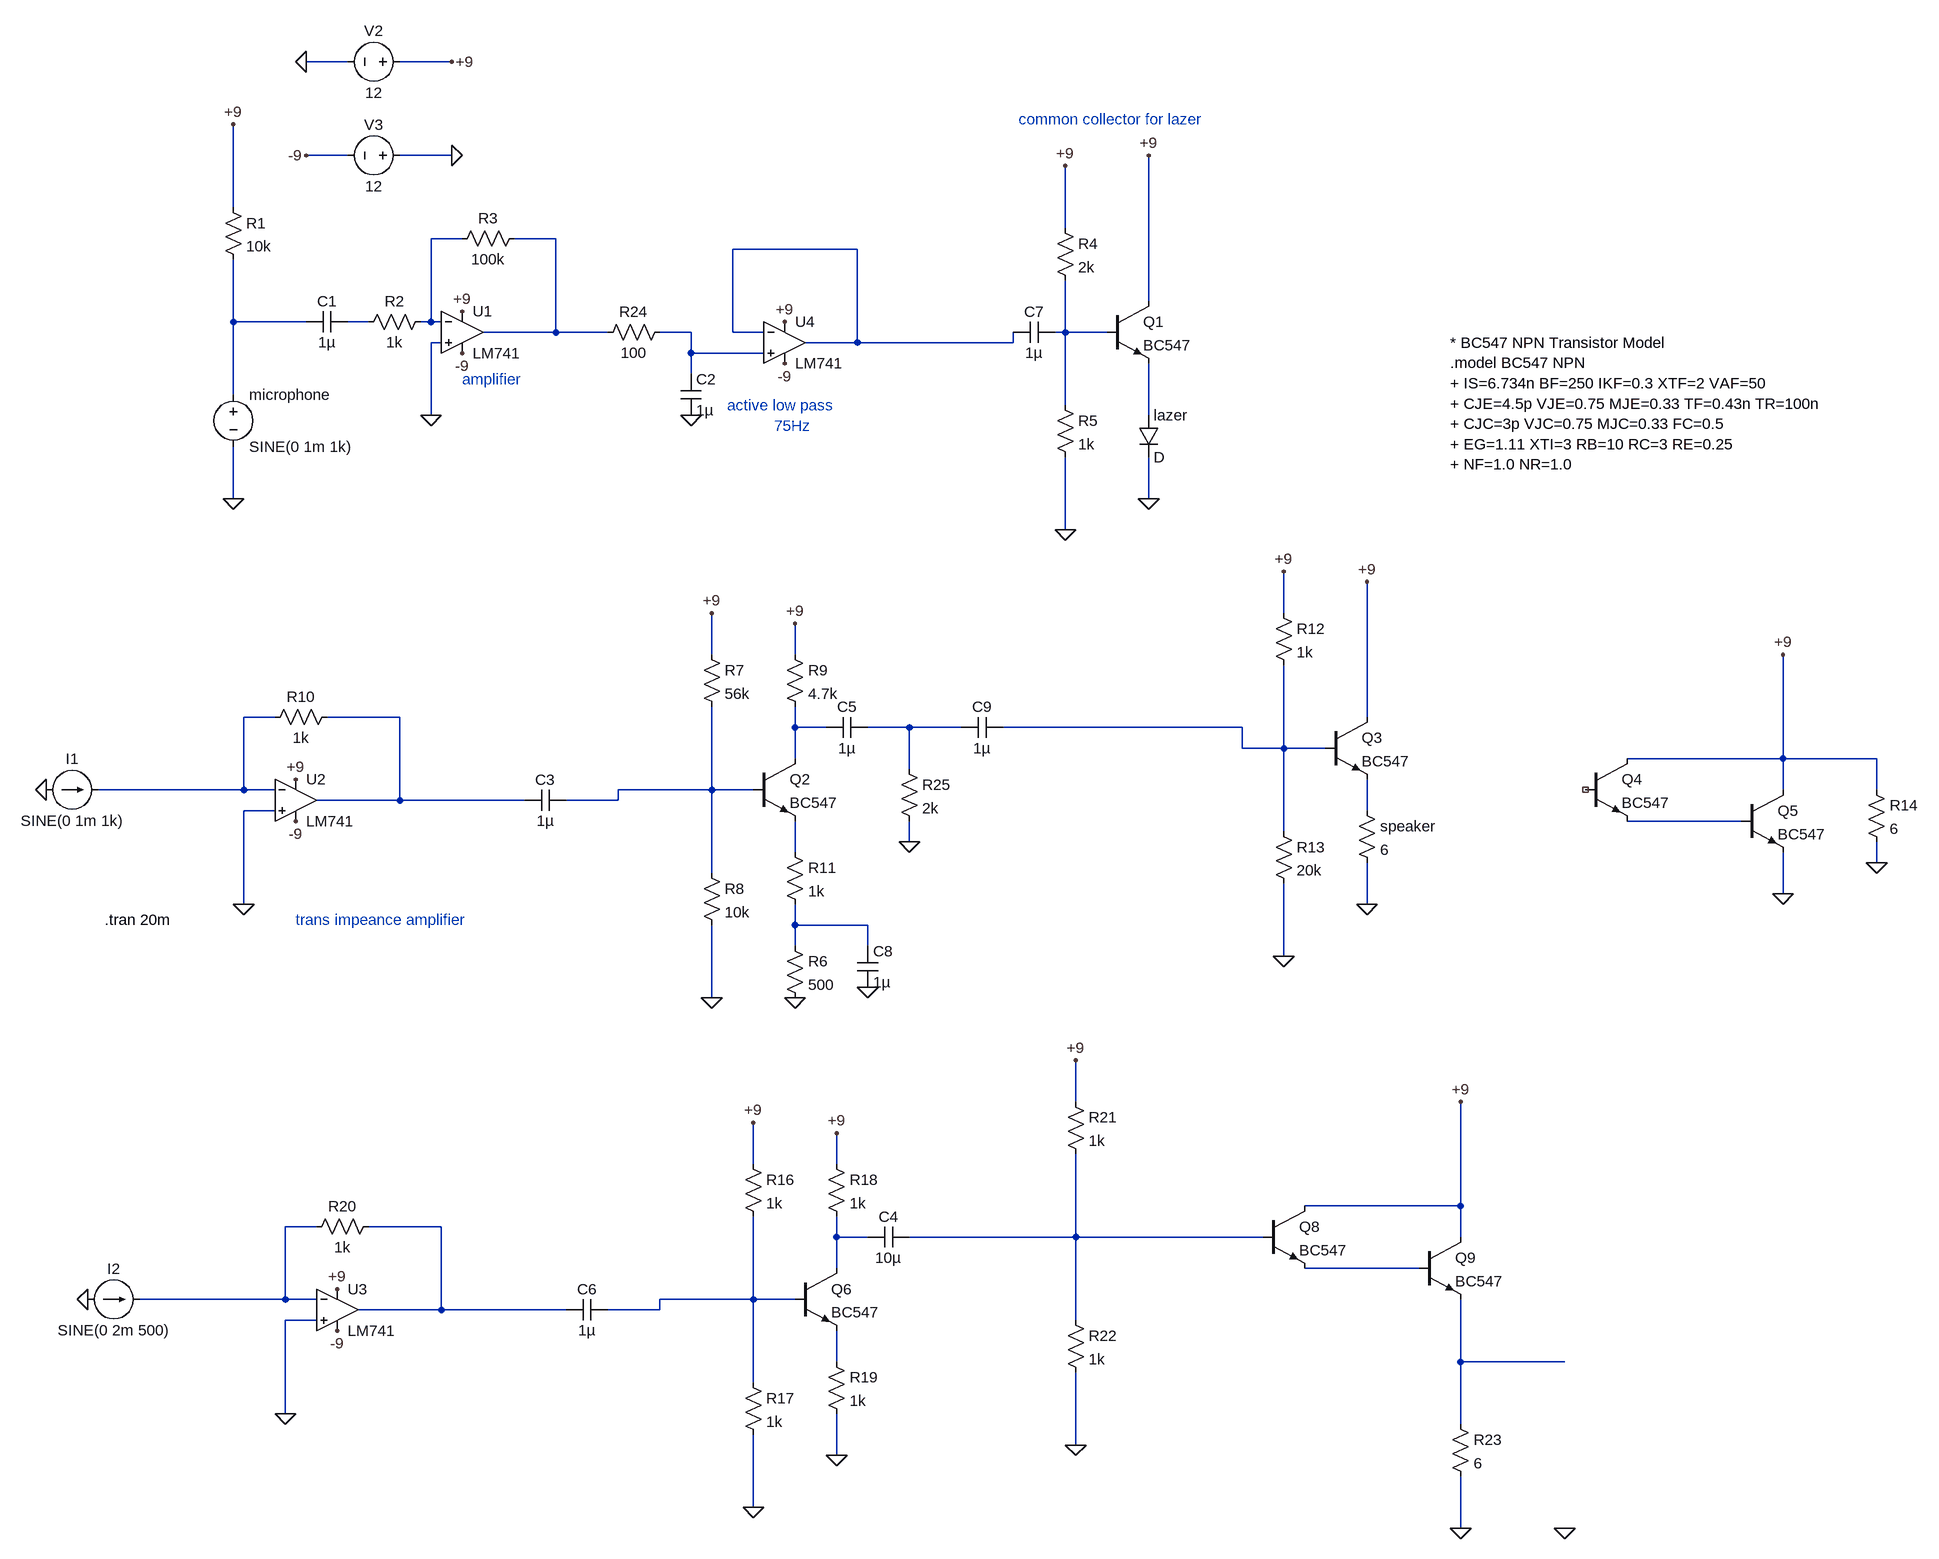
[diagram p0: schematic Draft70.asc]
Draft70.asc, the LTspice schematic file:
Version 4
SHEET 1 2564 1892
WIRE 144 -384 80 -384
WIRE 304 -384 224 -384
WIRE 144 -240 80 -240
WIRE 304 -240 224 -240
WIRE -32 -160 -32 -288
WIRE 1248 -128 1248 -224
WIRE 320 -112 272 -112
WIRE 464 -112 400 -112
WIRE 928 -96 736 -96
WIRE 1376 -16 1376 -240
WIRE -32 16 -32 -80
WIRE 80 16 -32 16
WIRE 176 16 144 16
WIRE 272 16 272 -112
WIRE 272 16 256 16
WIRE 288 16 272 16
WIRE 464 32 464 -112
WIRE 464 32 352 32
WIRE 544 32 464 32
WIRE 672 32 624 32
WIRE 736 32 736 -96
WIRE 784 32 736 32
WIRE 1248 32 1248 -48
WIRE 1248 32 1232 32
WIRE 1312 32 1248 32
WIRE 288 48 272 48
WIRE 928 48 928 -96
WIRE 928 48 848 48
WIRE 1168 48 1168 32
WIRE 1168 48 928 48
WIRE 672 64 672 32
WIRE 784 64 672 64
WIRE 672 96 672 64
WIRE -32 128 -32 16
WIRE 1248 144 1248 32
WIRE 272 160 272 48
WIRE 1376 160 1376 80
WIRE -32 288 -32 208
WIRE 1376 288 1376 224
WIRE 1248 336 1248 224
WIRE 1584 464 1584 400
WIRE 704 528 704 464
WIRE 832 528 832 480
WIRE 32 624 -16 624
WIRE 224 624 112 624
WIRE 1712 624 1712 416
WIRE 832 640 832 608
WIRE 880 640 832 640
WIRE 1008 640 944 640
WIRE 1088 640 1008 640
WIRE 1520 640 1152 640
WIRE 1520 672 1520 640
WIRE 1584 672 1584 544
WIRE 1584 672 1520 672
WIRE 1648 672 1584 672
WIRE 832 688 832 640
WIRE 2352 688 2352 528
WIRE 2352 688 2112 688
WIRE 2496 688 2352 688
WIRE 1008 704 1008 640
WIRE -16 736 -16 624
WIRE -16 736 -240 736
WIRE 32 736 -16 736
WIRE 704 736 704 608
WIRE 704 736 560 736
WIRE 768 736 704 736
WIRE 2352 736 2352 688
WIRE 2496 736 2496 688
WIRE 224 752 224 624
WIRE 224 752 96 752
WIRE 416 752 224 752
WIRE 560 752 560 736
WIRE 560 752 480 752
WIRE 32 768 -16 768
WIRE 1712 768 1712 720
WIRE 2288 784 2112 784
WIRE 1584 800 1584 672
WIRE 1008 816 1008 784
WIRE 832 832 832 784
WIRE 2496 848 2496 816
WIRE 704 864 704 736
WIRE 2352 896 2352 832
WIRE -16 912 -16 768
WIRE 1712 912 1712 848
WIRE 832 944 832 912
WIRE 944 944 832 944
WIRE 832 976 832 944
WIRE 944 976 944 944
WIRE 1584 992 1584 880
WIRE 704 1056 704 944
WIRE 1264 1216 1264 1152
WIRE 768 1312 768 1248
WIRE 896 1312 896 1264
WIRE 1856 1376 1856 1216
WIRE 1856 1376 1616 1376
WIRE 96 1408 48 1408
WIRE 288 1408 176 1408
WIRE 896 1424 896 1392
WIRE 944 1424 896 1424
WIRE 1264 1424 1264 1296
WIRE 1264 1424 1008 1424
WIRE 1552 1424 1264 1424
WIRE 1856 1424 1856 1376
WIRE 896 1472 896 1424
WIRE 1792 1472 1616 1472
WIRE 48 1520 48 1408
WIRE 48 1520 -176 1520
WIRE 96 1520 48 1520
WIRE 768 1520 768 1392
WIRE 768 1520 624 1520
WIRE 832 1520 768 1520
WIRE 288 1536 288 1408
WIRE 288 1536 160 1536
WIRE 480 1536 288 1536
WIRE 624 1536 624 1520
WIRE 624 1536 544 1536
WIRE 96 1552 48 1552
WIRE 1264 1552 1264 1424
WIRE 896 1616 896 1568
WIRE 1856 1616 1856 1520
WIRE 2016 1616 1856 1616
WIRE 768 1648 768 1520
WIRE 48 1696 48 1552
WIRE 1856 1712 1856 1616
WIRE 1264 1744 1264 1632
WIRE 896 1760 896 1696
WIRE 768 1840 768 1728
WIRE 1856 1872 1856 1792
FLAG 1376 288 0
FLAG 1248 336 0
FLAG 272 160 0
FLAG -32 288 0
FLAG 304 -240 0
FLAG 80 -384 0
FLAG 304 -384 +9
FLAG 320 0 +9
FLAG -32 -288 +9
FLAG 1248 -224 +9
FLAG 1376 -240 +9
FLAG 320 64 -9
FLAG 704 464 +9
FLAG 832 480 +9
FLAG 704 1056 0
FLAG -320 736 0
FLAG -16 912 0
FLAG 64 784 -9
FLAG 64 720 +9
FLAG 1584 400 +9
FLAG 1712 416 +9
FLAG 1584 992 0
FLAG 1712 912 0
FLAG 2352 896 0
FLAG 2352 528 +9
FLAG 2496 848 0
FLAG 768 1248 +9
FLAG 896 1264 +9
FLAG 768 1840 0
FLAG -256 1520 0
FLAG 896 1760 0
FLAG 48 1696 0
FLAG 128 1568 -9
FLAG 128 1504 +9
FLAG 1264 1152 +9
FLAG 1264 1744 0
FLAG 1856 1216 +9
FLAG 2016 1872 0
FLAG 1856 1872 0
FLAG 80 -240 -9
FLAG 672 160 0
FLAG 816 16 +9
FLAG 816 80 -9
FLAG 832 1056 0
FLAG 944 1040 0
FLAG 1008 816 0
SYMBOL voltage -32 112 R0
WINDOW 123 0 0 Left 0
WINDOW 39 0 0 Left 0
SYMATTR InstName microphone
SYMATTR Value SINE(0 1m 1k)
SYMBOL res -48 -176 R0
SYMATTR InstName R1
SYMATTR Value 10k
SYMBOL cap 144 0 R90
WINDOW 0 0 32 VBottom 2
WINDOW 3 32 32 VTop 2
SYMATTR InstName C1
SYMATTR Value 1µ
SYMBOL OpAmps\\LM741 320 -32 R0
SYMATTR InstName U1
SYMBOL res 272 0 R90
WINDOW 0 0 56 VBottom 2
WINDOW 3 32 56 VTop 2
SYMATTR InstName R2
SYMATTR Value 1k
SYMBOL res 416 -128 R90
WINDOW 0 0 56 VBottom 2
WINDOW 3 32 56 VTop 2
SYMATTR InstName R3
SYMATTR Value 100k
SYMBOL res 1232 -144 R0
SYMATTR InstName R4
SYMATTR Value 2k
SYMBOL res 1232 128 R0
SYMATTR InstName R5
SYMATTR Value 1k
SYMBOL npn 1312 -16 R0
SYMATTR InstName Q1
SYMATTR Value BC547
SYMBOL voltage 240 -384 R90
WINDOW 0 -32 56 VBottom 2
WINDOW 3 32 56 VTop 2
WINDOW 123 0 0 Left 0
WINDOW 39 0 0 Left 0
SYMATTR InstName V2
SYMATTR Value 12
SYMBOL voltage 240 -240 R90
WINDOW 0 -32 56 VBottom 2
WINDOW 3 32 56 VTop 2
WINDOW 123 0 0 Left 0
WINDOW 39 0 0 Left 0
SYMATTR InstName V3
SYMATTR Value 12
SYMBOL res 688 512 R0
SYMATTR InstName R7
SYMATTR Value 56k
SYMBOL res 688 848 R0
SYMATTR InstName R8
SYMATTR Value 10k
SYMBOL res 816 512 R0
SYMATTR InstName R9
SYMATTR Value 4.7k
SYMBOL npn 768 688 R0
SYMATTR InstName Q2
SYMATTR Value BC547
SYMBOL cap 944 624 R90
WINDOW 0 0 32 VBottom 2
WINDOW 3 32 32 VTop 2
SYMATTR InstName C5
SYMATTR Value 1µ
SYMBOL res 816 816 R0
SYMATTR InstName R11
SYMATTR Value 1k
SYMBOL OpAmps\\LM741 64 688 R0
SYMATTR InstName U2
SYMBOL res 128 608 R90
WINDOW 0 0 56 VBottom 2
WINDOW 3 32 56 VTop 2
SYMATTR InstName R10
SYMATTR Value 1k
SYMBOL cap 480 736 R90
WINDOW 0 0 32 VBottom 2
WINDOW 3 32 32 VTop 2
SYMATTR InstName C3
SYMATTR Value 1µ
SYMBOL current -320 736 R270
WINDOW 0 32 40 VTop 2
WINDOW 3 -32 40 VBottom 2
WINDOW 123 0 0 Left 0
WINDOW 39 0 0 Left 0
SYMATTR InstName I1
SYMATTR Value SINE(0 1m 1k)
SYMBOL res 1568 448 R0
SYMATTR InstName R12
SYMATTR Value 1k
SYMBOL res 1568 784 R0
SYMATTR InstName R13
SYMATTR Value 20k
SYMBOL npn 1648 624 R0
SYMATTR InstName Q3
SYMATTR Value BC547
SYMBOL res 1696 752 R0
SYMATTR InstName speaker
SYMATTR Value 6
SYMBOL npn 2048 688 R0
SYMATTR InstName Q4
SYMATTR Value BC547
SYMBOL npn 2288 736 R0
SYMATTR InstName Q5
SYMATTR Value BC547
SYMBOL res 2480 720 R0
SYMATTR InstName R14
SYMATTR Value 6
SYMBOL res 752 1296 R0
SYMATTR InstName R16
SYMATTR Value 1k
SYMBOL res 752 1632 R0
SYMATTR InstName R17
SYMATTR Value 1k
SYMBOL res 880 1296 R0
SYMATTR InstName R18
SYMATTR Value 1k
SYMBOL npn 832 1472 R0
SYMATTR InstName Q6
SYMATTR Value BC547
SYMBOL cap 1008 1408 R90
WINDOW 0 0 32 VBottom 2
WINDOW 3 32 32 VTop 2
SYMATTR InstName C4
SYMATTR Value 10µ
SYMBOL res 880 1600 R0
SYMATTR InstName R19
SYMATTR Value 1k
SYMBOL OpAmps\\LM741 128 1472 R0
SYMATTR InstName U3
SYMBOL res 192 1392 R90
WINDOW 0 0 56 VBottom 2
WINDOW 3 32 56 VTop 2
SYMATTR InstName R20
SYMATTR Value 1k
SYMBOL cap 544 1520 R90
WINDOW 0 0 32 VBottom 2
WINDOW 3 32 32 VTop 2
SYMATTR InstName C6
SYMATTR Value 1µ
SYMBOL current -256 1520 R270
WINDOW 0 32 40 VTop 2
WINDOW 3 -32 40 VBottom 2
WINDOW 123 0 0 Left 0
WINDOW 39 0 0 Left 0
SYMATTR InstName I2
SYMATTR Value SINE(0 2m 500)
SYMBOL res 1248 1200 R0
SYMATTR InstName R21
SYMATTR Value 1k
SYMBOL res 1248 1536 R0
SYMATTR InstName R22
SYMATTR Value 1k
SYMBOL npn 1552 1376 R0
SYMATTR InstName Q8
SYMATTR Value BC547
SYMBOL npn 1792 1424 R0
SYMATTR InstName Q9
SYMATTR Value BC547
SYMBOL res 1840 1696 R0
SYMATTR InstName R23
SYMATTR Value 6
SYMBOL cap 1232 16 R90
WINDOW 0 0 32 VBottom 2
WINDOW 3 32 32 VTop 2
SYMATTR InstName C7
SYMATTR Value 1µ
SYMBOL OpAmps\\LM741 816 -16 R0
SYMATTR InstName U4
SYMBOL res 640 16 R90
WINDOW 0 0 56 VBottom 2
WINDOW 3 32 56 VTop 2
SYMATTR InstName R24
SYMATTR Value 100
SYMBOL cap 656 96 R0
SYMATTR InstName C2
SYMATTR Value 1µ
SYMBOL res 816 960 R0
SYMATTR InstName R6
SYMATTR Value 500
SYMBOL cap 928 976 R0
SYMATTR InstName C8
SYMATTR Value 1µ
SYMBOL res 992 688 R0
SYMATTR InstName R25
SYMATTR Value 2k
SYMBOL cap 1152 624 R90
WINDOW 0 0 32 VBottom 2
WINDOW 3 32 32 VTop 2
SYMATTR InstName C9
SYMATTR Value 1µ
SYMBOL diode 1360 160 R0
SYMATTR InstName lazer
TEXT 1840 48 Left 2 !* BC547 NPN Transistor Model\n.model BC547 NPN\n+ IS=6.734n BF=250 IKF=0.3 XTF=2 VAF=50\n+ CJE=4.5p VJE=0.75 MJE=0.33 TF=0.43n TR=100n\n+ CJC=3p VJC=0.75 MJC=0.33 FC=0.5\n+ EG=1.11 XTI=3 RB=10 RC=3 RE=0.25\n+ NF=1.0 NR=1.0
TEXT -230 936 Left 2 !.tran 20m
TEXT 320 104 Left 2 ;amplifier
TEXT 728 144 Left 2 ;active low pass
TEXT 800 176 Left 2 ;75Hz
TEXT 1176 -296 Left 2 ;common collector for lazer
TEXT 64 936 Left 2 ;trans impeance amplifier

The netlist it stands for:
* Draft70.asc
V§microphone N004 0 SINE(0 1m 1k)
R1 +9 N004 10k
C1 N005 N004 1µ
XU1 0 N001 +9 -9 N002 LM741  ; pins In+ In- V+ V- OUT
R2 N001 N005 1k
R3 N002 N001 100k
R4 +9 N007 2k
R5 N007 0 1k
Q1 +9 N007 N008 0 BC547
V2 +9 0 12
V3 0 -9 12
R7 +9 N014 56k
R8 N014 0 10k
R9 +9 N011 4.7k
Q2 N011 N014 N017 0 BC547
C5 N012 N011 1µ
R11 N017 N018 1k
XU2 0 N009 +9 -9 N010 LM741  ; pins In+ In- V+ V- OUT
R10 N010 N009 1k
C3 N014 N010 1µ
I1 0 N009 SINE(0 1m 1k)
R12 +9 N013 1k
R13 N013 0 20k
Q3 +9 N013 N015 0 BC547
R§speaker N015 0 6
Q4 +9 NC_01 N016 0 BC547
Q5 +9 N016 0 0 BC547
R14 +9 0 6
R16 +9 N024 1k
R17 N024 0 1k
R18 +9 N021 1k
Q6 N021 N024 N025 0 BC547
C4 N022 N021 10µ
R19 N025 0 1k
XU3 0 N019 +9 -9 N020 LM741  ; pins In+ In- V+ V- OUT
R20 N020 N019 1k
C6 N024 N020 1µ
I2 0 N019 SINE(0 2m 500)
R21 +9 N022 1k
R22 N022 0 1k
Q8 +9 N022 N023 0 BC547
Q9 +9 N023 N026 0 BC547
R23 N026 0 6
C7 N007 N003 1µ
XU4 N006 N003 +9 -9 N003 LM741  ; pins In+ In- V+ V- OUT
R24 N006 N002 100
C2 N006 0 1µ
R6 N018 0 500
C8 N018 0 1µ
R25 N012 0 2k
C9 N013 N012 1µ
D§lazer N008 0 D
.model D D
.lib standard.dio
.model NPN NPN
.model PNP PNP
.lib standard.bjt
* BC547 NPN Transistor Model
.model BC547 NPN
+ IS=6.734n BF=250 IKF=0.3 XTF=2 VAF=50
+ CJE=4.5p VJE=0.75 MJE=0.33 TF=0.43n TR=100n
+ CJC=3p VJC=0.75 MJC=0.33 FC=0.5
+ EG=1.11 XTI=3 RB=10 RC=3 RE=0.25
+ NF=1.0 NR=1.0
.tran 20m
* amplifier
* active low pass
* 75Hz
* common collector for lazer
* trans impeance amplifier
.lib LM741.lib
.backanno
.end